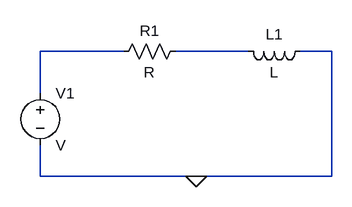
[diagram p0: schematic RL circuit.asc]
RL circuit.asc, the LTspice schematic file:
Version 4.1
SHEET 1 880 680
WIRE 112 128 -16 128
WIRE 304 128 192 128
WIRE 432 128 384 128
WIRE -16 192 -16 128
WIRE -16 320 -16 272
WIRE 224 320 -16 320
WIRE 432 320 432 128
WIRE 432 320 224 320
FLAG 224 320 0
SYMBOL res 208 112 R90
WINDOW 0 0 56 VBottom 2
WINDOW 3 32 56 VTop 2
SYMATTR InstName R1
SYMBOL ind 400 112 R90
WINDOW 0 5 56 VBottom 2
WINDOW 3 32 56 VTop 2
SYMATTR InstName L1
SYMBOL voltage -16 176 R0
SYMATTR InstName V1

The netlist it stands for:
* RL circuit.asc
R1 N002 N001 R
L1 0 N002 L
V1 N001 0 V
.backanno
.end